# EAGLE design RC oscillator (EAGLE 9.6.2)
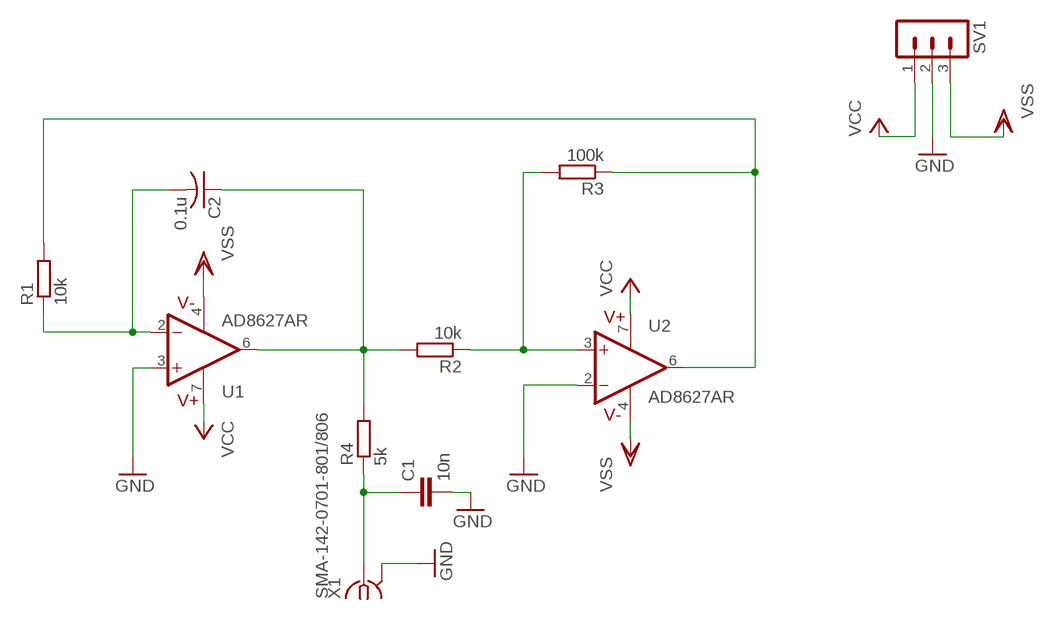
[diagram p0: schematic, sheet 1]

## Parts
C1  10n  C-EU025-030X050  [C025-030X050]
C2  0.1u  C-USC0504  [C0504]
R1  10k  R-EU_R0805  [R0805]
R2  10k  R-EU_R0805  [R0805]
R3  100k  R-EU_R0805  [R0805]
R4  5k  R-EU_R0805  [R0805]
SV1  MA03-1  [MA03-1]
U1  AD8627AR  [SOIC8]
U2  AD8627AR  [SOIC8]
X1  SMA-142-0701-801/806  [J502-ND-142-0701-801/806]

## Nets
GND: C1.2 SV1.2 U1.3(+IN) U2.2(-IN) X1.G@1 X1.G@2 X1.G@3 X1.G@4
N$1: C2.2 R1.1 U1.2(-IN)
N$4: R1.2 R3.1 U2.6(OUT)
N$7: C2.1 R2.2 R4.2 U1.6(OUT)
N$9: R2.1 R3.2 U2.3(+IN)
N$10: C1.1 R4.1 X1.1
VCC: SV1.1 U1.7(V+) U2.7(V+)
VSS: SV1.3 U1.4(V-) U2.4(V-)

## Library data of the parts
C1 = rcl:C-EU: CAPACITOR, European symbol; SPICEPREFIX: C
C2 = rcl:C-US: CAPACITOR, American symbol; SPICEPREFIX: C
R1-R4 = rcl:R-EU_: RESISTOR, European symbol; SPICEPREFIX: R
SV1 = con-lstb:MA03-1: PIN HEADER; OC_FARNELL: unknown; OC_NEWARK: unknown
U1 U2 = analog_devices_gaui:AD8627
X1 = con-coax:SMA-: SMA 50 Ohm End Launch Jack Receptacle - Round Contact Johnson Components Source: www.johnsoncomponents.com .. J502-ND.pdf; MF: JOHNSON COMPONENTS; MPN: 142-0701-801; OC_FARNELL: 1608592; OC_NEWARK: 90F2624

## Board
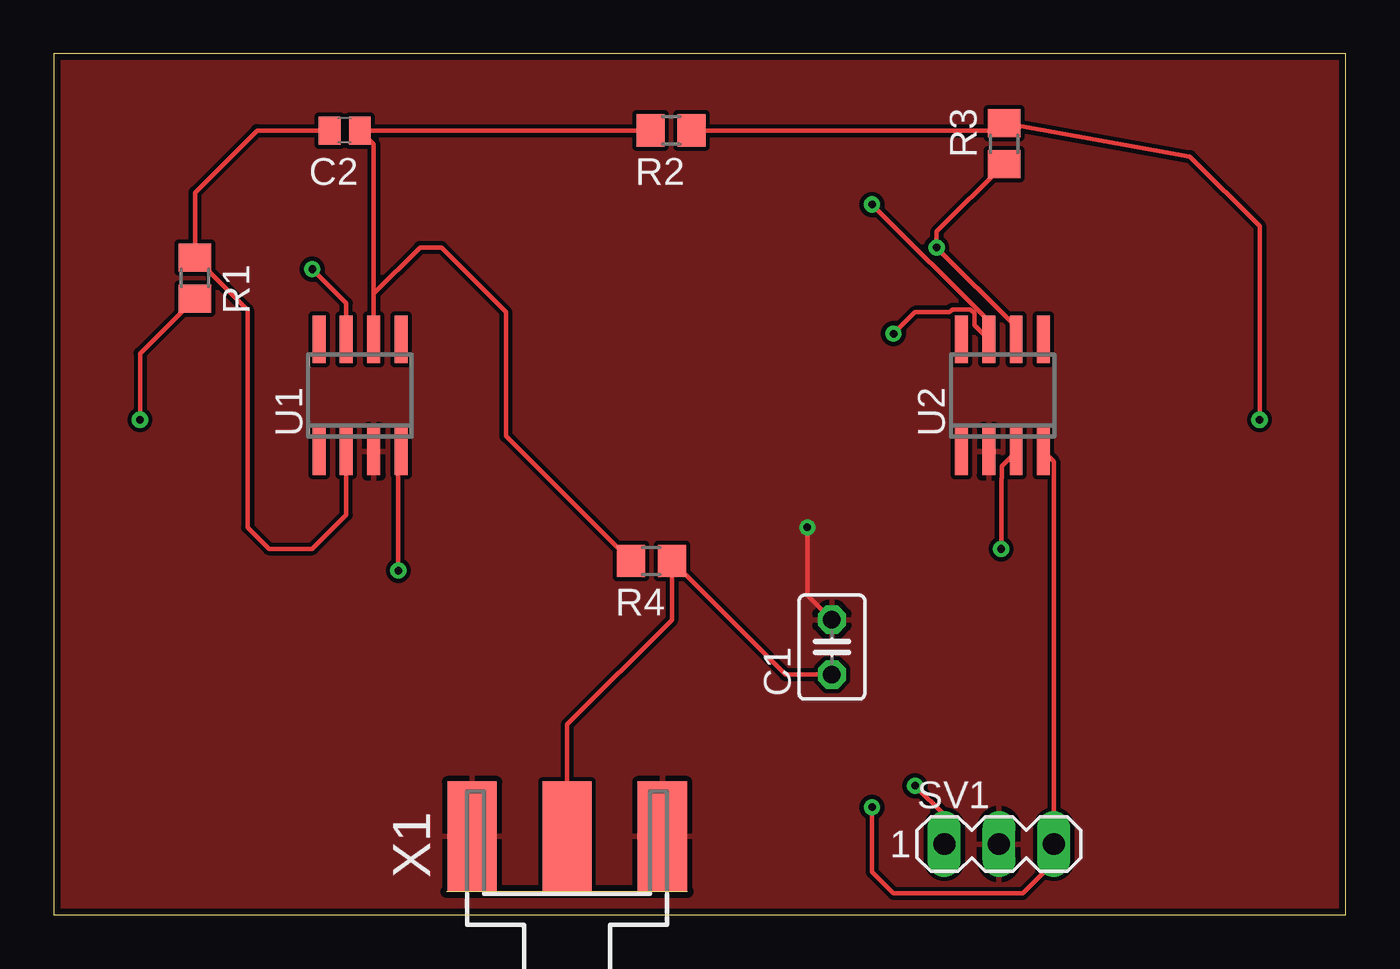
[diagram p1: board, top side]
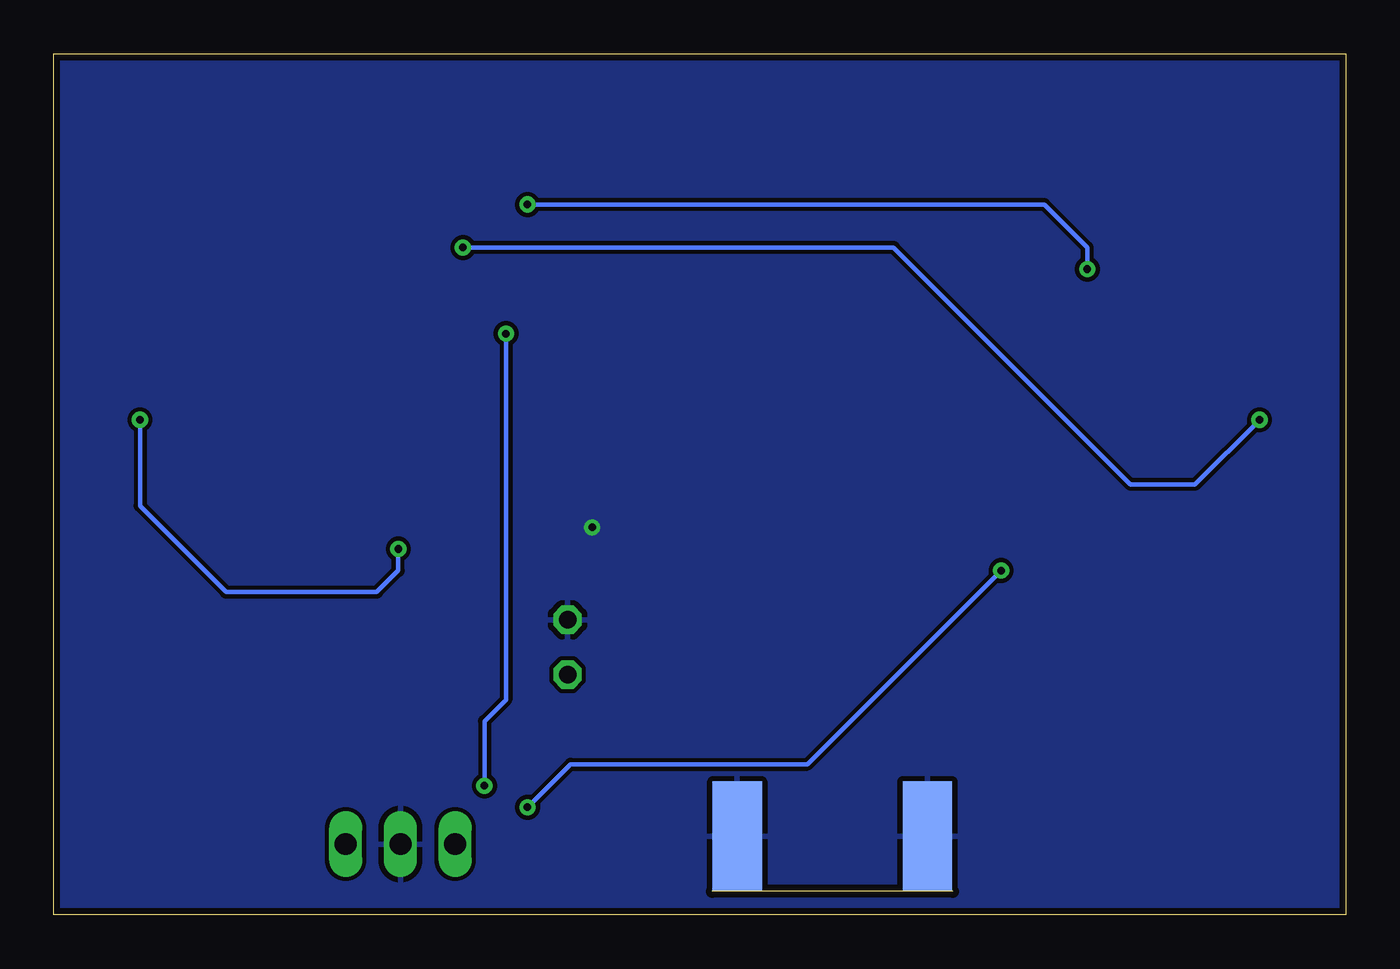
[diagram p2: board, bottom side, seen from below]

Size 60 x 40 mm. Coordinates in mm from the lower left corner, seen from the top.
Outline: 0,0 60,0 60,40 0,40 0,0
Copper layers (1*16): Top 0.035mm / dielectric 1.5mm / Bottom 0.035mm
Design rules "default *": minimum track width 0.2mm, minimum drill 0.35mm, track to track 0.2mm, track to pad 0.2mm, pad to pad 0.2mm, via to via 0.2mm, smd to smd 0.2mm, copper to edge 0.3mm, drill to drill 0.3mm, minimum pad ring 10mil, minimum via ring 8mil, stop-mask expansion 4mil, vias tented up to drill 0mil, thermal gap 10mil

### Footprints (pad centres in the part's own frame; a part is rotated, then mirrored left to right if it is on the bottom)
C025-030X050 = drill 0.813 octagon: 1 -1.27,0; 2 1.27,0
C0504 = smd 1 x 1.3: 1 -0.7,0; 2 0.7,0
R0805 = smd 1.3 x 1.5: 1 -0.95,0; 2 0.95,0
MA03-1 = drill 1.016 long: 1 -2.54,0; 2 0,0; 3 2.54,0
SOIC8 = smd 0.6 x 2.2: 1 -1.905,-2.6; 2 -0.635,-2.6; 3 0.635,-2.6; 4 1.905,-2.6; 5 1.905,2.6; 6 0.635,2.6; 7 -0.635,2.6; 8 -1.905,2.6
J502-ND-142-0701-801/806 = smd 5.08 x 2.286: 1 2.565,0; G@1 2.565,4.42; G@2 2.565,-4.42 | smd 5.08 x 2.286 bottom: G@3 2.565,4.42; G@4 2.565,-4.42

### Placement (x,y rotation side)
C1  36.14,12.44 90 top
C2  13.51,36.44 180 top
R1  6.56,29.59 270 top
R2  28.67,36.44 180 top
R3  44.14,35.82 90 top
R4  27.75,16.44 180 top
SV1  43.9,3.29 0 top
U1  14.22,24.13 0 top
U2  44.06,24.13 0 top
X1  23.84,1.09 90 top

### Tracks (layer width: path | path; a pad name or v marks a point on that pad's centre or on a via)
GND  (via drill 0.35)
  Top 0.2: 43.42,20.98 U2.2 | C1.2 35,14.85 v35,18
  pour Bottom: 0,0 60,0 60,40 0,40
  pour Top: 0,0 60,0 60,40 0,40
N$1
  Top 0.2: C2.2 9.44,36.44 6.56,33.56 R1.1 9,28.1 9,18 10,17 12,17 13.59,18.59 U1.2
N$4  (via drill 0.35)
  Top 0.2: R1.2 4,26.08 v4,23 | U2.6 44.7,27.3 v41,31 41,31.73 R3.1
  Bottom 0.2: v4,23 7,20 10,20 21,31 v41,31
N$7
  Top 0.2: 14.86,28.86 14.86,35.8 C2.1 R2.2 | U1.6 14.86,27 14.86,28.86 | R4.2 21,22.24 21,28 18,31 17,31 14.86,28.86
N$9  (via drill 0.35)
  Top 0.2: v56,23 56,32 52.77,35.23 R3.2 43.81,36.44 R2.1 | v44,17 44,20.28 44.02,20.31 44.02,20.86 U2.3
  Bottom 0.2: v56,23 56,19 52,15 45,15 44,16 v44,17
N$10
  Top 0.2: C1.1 33.97,11.17 R4.1 28.7,13.7 23.84,8.84 X1.1
VCC  (via drill 0.35)
  Top 0.2: U1.7 13.59,28.41 v12,30 | v38,33 43.42,27.57 U2.7 42.76,27.4 42.76,27.95 42.58,28.13 41.73,28.13 41.6,28 40,28 v39,27 | v40,6 41.36,4.64 SV1.1
  Bottom 0.2: v12,30 12,31 14,33 v38,33 | v39,27 39,10 40,9 v40,6
VSS  (via drill 0.35)
  Top 0.2: U2.4 46.44,21.05 SV1.3 46.44,2.44 45,1 39,1 38,2 v38,5 | v16,16 16,21.41 U1.4
  Bottom 0.2: v38,5 36,7 25,7 v16,16